# Altium schematic sheet Ethernet.SchDoc: {Наименование}
size 420 x 297 mm; DocumentNumber: ВКА.821011.000.ПЗ; PageSetup: Record=PageOptions|CenterHorizontal=False|CenterVertical=False|PrintScale=0.49|XCorrection=0.00|YCorrection=0.00|PrintKind=1|BorderSize=5000000|LeftOffset=0|BottomOffset=0|Orientation=2|PaperLength=4200|PaperWidth=2970|Scale=100|PaperSource=7|PrintQuality=600|MediaType=1|DitherType=10|PrintScaleMode=1|PaperKind=A3|PaperIndex=8; Rule: PcbType=ProtelPcb
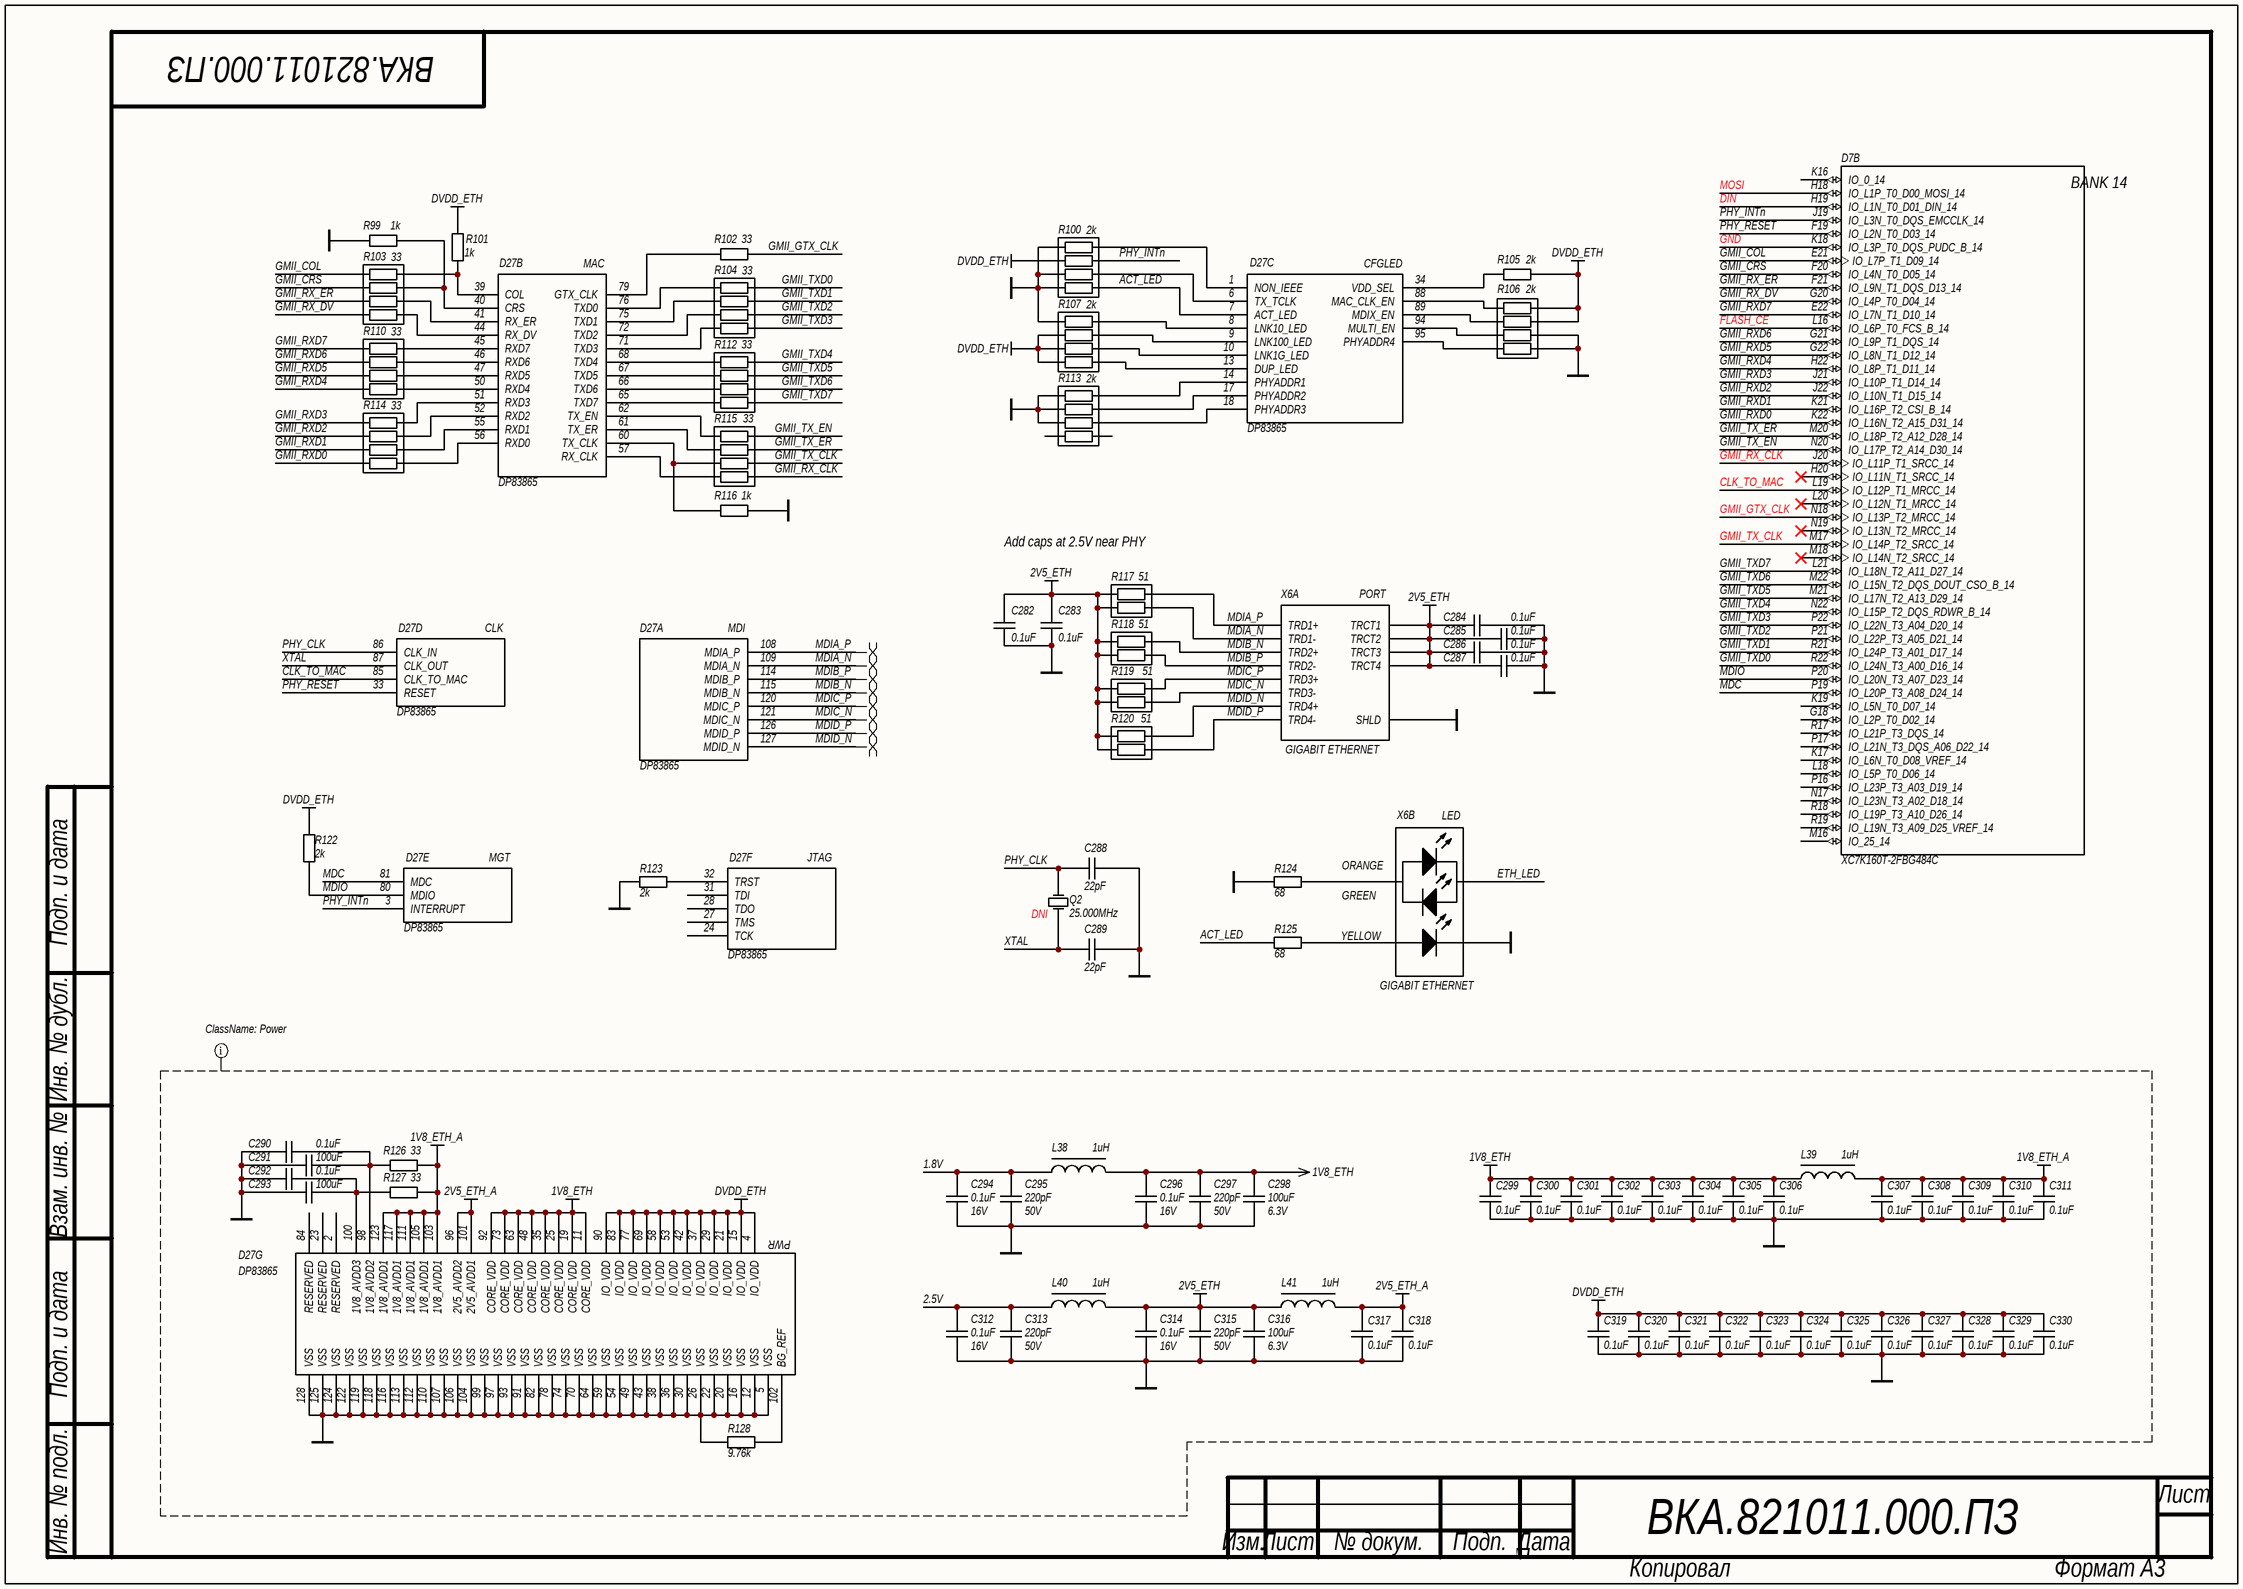
[diagram p0: Ethernet.SchDoc]

## Parts
C282  value 0.1uF  [C0402]  (hidden comment: CAP)
C283  value 0.1uF  [C0402]  (hidden comment: CAP)
C284  value 0.1uF  [C0402]  (hidden comment: CAP)
C285  value 0.1uF  [C0402]  (hidden comment: CAP)
C286  value 0.1uF  [C0402]  (hidden comment: CAP)
C287  value 0.1uF  [C0402]  (hidden comment: CAP)
C288  value 22pF  [C0402]  (hidden comment: CAP)
C289  value 22pF  [C0402]  (hidden comment: CAP)
C290  value 0.1uF  [C0402]  (hidden comment: CAP)
C291  value 100uF  [C1210]  (hidden comment: CAP uF)
C292  value 0.1uF  [C0402]  (hidden comment: CAP)
C293  value 100uF  [C1210]  (hidden comment: CAP uF)
C294  value 0.1uF  Voltage: 16V  [C0603]  (hidden comment: CAP)
C295  value 220pF  Voltage: 50V  [C0603]  (hidden comment: CAP)
C296  value 0.1uF  Voltage: 16V  [C0603]  (hidden comment: CAP)
C297  value 220pF  Voltage: 50V  [C0603]  (hidden comment: CAP)
C298  value 100uF  Voltage: 6.3V  [C1210]  (hidden comment: CAP uF)
C299  value 0.1uF  [C0402]  (hidden comment: CAP)
C300  value 0.1uF  [C0402]  (hidden comment: CAP)
C301  value 0.1uF  [C0402]  (hidden comment: CAP)
C302  value 0.1uF  [C0402]  (hidden comment: CAP)
C303  value 0.1uF  [C0402]  (hidden comment: CAP)
C304  value 0.1uF  [C0402]  (hidden comment: CAP)
C305  value 0.1uF  [C0402]  (hidden comment: CAP)
C306  value 0.1uF  [C0402]  (hidden comment: CAP)
C307  value 0.1uF  [C0402]  (hidden comment: CAP)
C308  value 0.1uF  [C0402]  (hidden comment: CAP)
C309  value 0.1uF  [C0402]  (hidden comment: CAP)
C310  value 0.1uF  [C0402]  (hidden comment: CAP)
C311  value 0.1uF  [C0402]  (hidden comment: CAP)
C312  value 0.1uF  Voltage: 16V  [C0603]  (hidden comment: CAP)
C313  value 220pF  Voltage: 50V  [C0603]  (hidden comment: CAP)
C314  value 0.1uF  Voltage: 16V  [C0603]  (hidden comment: CAP)
C315  value 220pF  Voltage: 50V  [C0603]  (hidden comment: CAP)
C316  value 100uF  Voltage: 6.3V  [C1210]  (hidden comment: CAP uF)
C317  value 0.1uF  [C0402]  (hidden comment: CAP)
C318  value 0.1uF  [C0402]  (hidden comment: CAP)
C319  value 0.1uF  [C0402]  (hidden comment: CAP)
C320  value 0.1uF  [C0402]  (hidden comment: CAP)
C321  value 0.1uF  [C0402]  (hidden comment: CAP)
C322  value 0.1uF  [C0402]  (hidden comment: CAP)
C323  value 0.1uF  [C0402]  (hidden comment: CAP)
C324  value 0.1uF  [C0402]  (hidden comment: CAP)
C325  value 0.1uF  [C0402]  (hidden comment: CAP)
C326  value 0.1uF  [C0402]  (hidden comment: CAP)
C327  value 0.1uF  [C0402]  (hidden comment: CAP)
C328  value 0.1uF  [C0402]  (hidden comment: CAP)
C329  value 0.1uF  [C0402]  (hidden comment: CAP)
C330  value 0.1uF  [C0402]  (hidden comment: CAP)
D7  XC7K160T-2FBG484C  [FBG484]  (part B of 12)
D27  DP83865  [PQFP-128]  (parts A,B,C,D,E,F,G of 7)
L38  value 1uH  [L1210_Murata LQH]  (hidden comment: Inductor LF)
L39  value 1uH  [L1210_Murata LQH]  (hidden comment: Inductor LF)
L40  value 1uH  [L1210_Murata LQH]  (hidden comment: Inductor LF)
L41  value 1uH  [L1210_Murata LQH]  (hidden comment: Inductor LF)
Q2  25.000MHz  Note: DNI  [SMT 5x7]
R99  value 1k  [R0402]  (hidden comment: RES)
R100  value 2k  [EXN8V]  (hidden comment: RES 4x0402)
R101  value 1k  [R0402]  (hidden comment: RES)
R102  value 33  [R0402]  (hidden comment: RES)
R103  value 33  [EXN8V]  (hidden comment: RES 4x0402)
R104  value 33  [EXN8V]  (hidden comment: RES 4x0402)
R105  value 2k  [R0402]  (hidden comment: RES)
R106  value 2k  [EXN8V]  (hidden comment: RES 4x0402)
R107  value 2k  [EXN8V]  (hidden comment: RES 4x0402)
R110  value 33  [EXN8V]  (hidden comment: RES 4x0402)
R112  value 33  [EXN8V]  (hidden comment: RES 4x0402)
R113  value 2k  [EXN8V]  (hidden comment: RES 4x0402)
R114  value 33  [EXN8V]  (hidden comment: RES 4x0402)
R115  value 33  [EXN8V]  (hidden comment: RES 4x0402)
R116  value 1k  [R0402]  (hidden comment: RES)
R117  value 51  [EX24V]  (hidden comment: RES 2x0402)
R118  value 51  [EX24V]  (hidden comment: RES 2x0402)
R119  value 51  [EX24V]  (hidden comment: RES 2x0402)
R120  value 51  [EX24V]  (hidden comment: RES 2x0402)
R122  value 2k  [R0402]  (hidden comment: RES)
R123  value 2k  [R0402]  (hidden comment: RES)
R124  value 68  [R0402]  (hidden comment: RES)
R125  value 68  [R0402]  (hidden comment: RES)
R126  value 33  [R0402]  (hidden comment: RES)
R127  value 33  [R0402]  (hidden comment: RES)
R128  value 9.76k  [R0402]  (hidden comment: RES)
X6  GIGABIT ETHERNET  [0826-1X1T-23-F]  (parts A,B of 2)

## Nets
1V8_ETH: C296.2 C297.2 C298.2 C299.2 C300.2 C301.2 C302.2 C303.2 C304.2 C305.2 C306.2 D27.11(CORE_VDD) D27.19(CORE_VDD) D27.25(CORE_VDD) D27.35(CORE_VDD) D27.48(CORE_VDD) D27.63(CORE_VDD) D27.73(CORE_VDD) D27.92(CORE_VDD) L38.2 L39.1
1V8_ETH_A: C307.2 C308.2 C309.2 C310.2 C311.2 D27.103(1V8_AVDD1) D27.105(1V8_AVDD1) D27.111(1V8_AVDD1) D27.117(1V8_AVDD1) D27.123(1V8_AVDD1) L39.2 R126.1 R127.1
2V5_ETH: C282.1 C283.1 C284.2 C285.2 C286.2 C287.2 C314.2 C315.2 C316.2 L40.2 L41.1 R117.1 R117.2 R118.1 R118.2 R119.1 R119.2 R120.1 R120.2 X6.1(TRCT3) X6.6(TRCT2) X6.7(TRCT4) X6.12(TRCT1)
2V5_ETH_A: C317.2 C318.2 D27.96(2V5_AVDD2) D27.101(2V5_AVDD1) L41.2
DVDD_ETH: C319.2 C320.2 C321.2 C322.2 C323.2 C324.2 C325.2 C326.2 C327.2 C328.2 C329.2 C330.2 D27.4(IO_VDD) D27.15(IO_VDD) D27.21(IO_VDD) D27.29(IO_VDD) D27.37(IO_VDD) D27.42(IO_VDD) D27.53(IO_VDD) D27.58(IO_VDD) D27.69(IO_VDD) D27.77(IO_VDD) D27.83(IO_VDD) D27.90(IO_VDD) R100.2 R101.2 R105.2 R106.5 R106.6 R107.2 R107.3 R107.4 R122.1
GND: C282.2 C283.2 C284.1 C285.1 C286.1 C287.1 C288.2 C289.2 C290.2 C291.2 C292.2 C293.2 C294.1 C295.1 C296.1 C297.1 C298.1 C299.1 C300.1 C301.1 C302.1 C303.1 C304.1 C305.1 C306.1 C307.1 C308.1 C309.1 C310.1 C311.1 C312.1 C313.1 C314.1 C315.1 C316.1 C317.1 C318.1 C319.1 C320.1 C321.1 C322.1 C323.1 C324.1 C325.1 C326.1 C327.1 C328.1 C329.1 C330.1 D7.K18(IO_L3P_T0_DQS_PUDC_B_14) D27.5(VSS) D27.12(VSS) D27.16(VSS) D27.20(VSS) D27.22(VSS) D27.26(VSS) D27.30(VSS) D27.36(VSS) D27.38(VSS) D27.43(VSS) D27.49(VSS) D27.54(VSS) D27.59(VSS) D27.64(VSS) D27.70(VSS) D27.74(VSS) D27.78(VSS) D27.82(VSS) D27.91(VSS) D27.93(VSS) D27.97(VSS) D27.99(VSS) D27.104(VSS) D27.106(VSS) D27.107(VSS) D27.110(VSS) D27.112(VSS) D27.113(VSS) D27.116(VSS) D27.118(VSS) D27.119(VSS) D27.122(VSS) D27.124(VSS) D27.125(VSS) D27.128(VSS) R99.2 R100.1 R100.3 R100.4 R106.7 R106.8 R107.1 R113.1 R113.2 R113.3 R116.2 R123.1 R124.1 R128.2 X6.0(SHLD) X6.13(LED1)
1.8V: C294.2 C295.2 L38.1
2.5V: C312.2 C313.2 L40.1
ACT_LED: D27.7(ACT_LED) R100.5 R125.1
CLK_TO_MAC: D7.L19(IO_L12P_T1_MRCC_14) D27.85(CLK_TO_MAC)
DIN: D7.H19(IO_L1N_T0_D01_DIN_14)
ETH_LED: X6.16(LED2)
FLASH_CE: D7.L16(IO_L6P_T0_FCS_B_14)
GMII_COL: D7.E21(IO_L7P_T1_D09_14) R103.1
GMII_CRS: D7.F20(IO_L4N_T0_D05_14) R103.2
GMII_GTX_CLK: D7.N18(IO_L13P_T2_MRCC_14) R102.2
GMII_RX_CLK: D7.J20(IO_L11P_T1_SRCC_14) R115.1
GMII_RX_DV: D7.G20(IO_L4P_T0_D04_14) R103.4
GMII_RX_ER: D7.F21(IO_L9N_T1_DQS_D13_14) R103.3
GMII_RXD0: D7.K22(IO_L16N_T2_A15_D31_14) R114.4
GMII_RXD1: D7.K21(IO_L16P_T2_CSI_B_14) R114.3
GMII_RXD2: D7.J22(IO_L10N_T1_D15_14) R114.2
GMII_RXD3: D7.J21(IO_L10P_T1_D14_14) R114.1
GMII_RXD4: D7.H22(IO_L8P_T1_D11_14) R110.4
GMII_RXD5: D7.G22(IO_L8N_T1_D12_14) R110.3
GMII_RXD6: D7.G21(IO_L9P_T1_DQS_14) R110.2
GMII_RXD7: D7.E22(IO_L7N_T1_D10_14) R110.1
GMII_TX_CLK: D7.M17(IO_L14P_T2_SRCC_14) R115.2
GMII_TX_EN: D7.N20(IO_L17P_T2_A14_D30_14) R115.4
GMII_TX_ER: D7.M20(IO_L18P_T2_A12_D28_14) R115.3
GMII_TXD0: D7.R22(IO_L24N_T3_A00_D16_14) R104.8
GMII_TXD1: D7.R21(IO_L24P_T3_A01_D17_14) R104.7
GMII_TXD2: D7.P21(IO_L22P_T3_A05_D21_14) R104.6
GMII_TXD3: D7.P22(IO_L22N_T3_A04_D20_14) R104.5
GMII_TXD4: D7.N22(IO_L15P_T2_DQS_RDWR_B_14) R112.4
GMII_TXD5: D7.M21(IO_L17N_T2_A13_D29_14) R112.3
GMII_TXD6: D7.M22(IO_L15N_T2_DQS_DOUT_CSO_B_14) R112.2
GMII_TXD7: D7.L21(IO_L18N_T2_A11_D27_14) R112.1
MDC: D7.P19(IO_L20P_T3_A08_D24_14) D27.81(MDC)
MDIA_N: D27.109(MDIA_N) R117.3 X6.10(TRD1-)
MDIA_P: D27.108(MDIA_P) R117.4 X6.11(TRD1+)
MDIB_N: D27.115(MDIB_N) R118.4 X6.4(TRD2+)
MDIB_P: D27.114(MDIB_P) R118.3 X6.5(TRD2-)
MDIC_N: D27.121(MDIC_N) R119.4 X6.2(TRD3-)
MDIC_P: D27.120(MDIC_P) R119.3 X6.3(TRD3+)
MDID_N: D27.127(MDID_N) R120.3 X6.8(TRD4+)
MDID_P: D27.126(MDID_P) R120.4 X6.9(TRD4-)
MDIO: D7.P20(IO_L20N_T3_A07_D23_14) D27.80(MDIO) R122.2
MOSI: D7.H18(IO_L1P_T0_D00_MOSI_14)
PHY_CLK: C288.1 D27.86(CLK_IN) Q2.3(OSC2)
PHY_INTn: D7.J19(IO_L3N_T0_DQS_EMCCLK_14) D27.3(INTERRUPT) R100.7
PHY_RESET: D7.F19(IO_L2N_T0_D03_14) D27.33(RESET)
XTAL: C289.1 D27.87(CLK_OUT) Q2.1(OSC1)
NetC290_1: C290.1 C291.1 D27.98(1V8_AVDD2) R126.2
NetC292_1: C292.1 C293.1 D27.100(1V8_AVDD3) R127.2
NetD27_1: D27.1(NON_IEEE) R100.8
NetD27_6: D27.6(TX_TCLK) R100.6
NetD27_8: D27.8(LNK10_LED) R107.8
NetD27_9: D27.9(LNK100_LED) R107.7
NetD27_10: D27.10(LNK1G_LED) R107.6
NetD27_13: D27.13(DUP_LED) R107.5
NetD27_14: D27.14(PHYADDR1) R113.8
NetD27_17: D27.17(PHYADDR2) R113.7
NetD27_18: D27.18(PHYADDR3) R113.6
NetD27_32: D27.32(TRST) R123.2
NetD27_34: D27.34(VDD_SEL) R105.1
NetD27_39: D27.39(COL) R101.1 R103.8
NetD27_40: D27.40(CRS) R99.1 R103.7
NetD27_41: D27.41(RX_ER) R103.6
NetD27_44: D27.44(RX_DV) R103.5
NetD27_45: D27.45(RXD7) R110.8
NetD27_46: D27.46(RXD6) R110.7
NetD27_47: D27.47(RXD5) R110.6
NetD27_50: D27.50(RXD4) R110.5
NetD27_51: D27.51(RXD3) R114.8
NetD27_52: D27.52(RXD2) R114.7
NetD27_55: D27.55(RXD1) R114.6
NetD27_56: D27.56(RXD0) R114.5
NetD27_57: D27.57(RX_CLK) R115.8
NetD27_60: D27.60(TX_CLK) R115.7 R116.1
NetD27_61: D27.61(TX_ER) R115.6
NetD27_62: D27.62(TX_EN) R115.5
NetD27_65: D27.65(TXD7) R112.8
NetD27_66: D27.66(TXD6) R112.7
NetD27_67: D27.67(TXD5) R112.6
NetD27_68: D27.68(TXD4) R112.5
NetD27_71: D27.71(TXD3) R104.4
NetD27_72: D27.72(TXD2) R104.3
NetD27_75: D27.75(TXD1) R104.2
NetD27_76: D27.76(TXD0) R104.1
NetD27_79: D27.79(GTX_CLK) R102.1
NetD27_88: D27.88(MAC_CLK_EN) R106.4
NetD27_89: D27.89(MDIX_EN) R106.3
NetD27_94: D27.94(MULTI_EN) R106.2
NetD27_95: D27.95(PHYADDR4) R106.1
NetD27_102: D27.102(BG_REF) R128.1
NetR124_2: R124.2 X6.15
NetR125_2: R125.2 X6.14

Not connected (* = marked no-connect by the designer): D7 G18(IO_L2P_T0_D02_14) H20(IO_L11N_T1_SRCC_14)* K16(IO_0_14) K17(IO_L6N_T0_D08_VREF_14) K19(IO_L5N_T0_D07_14) L18(IO_L5P_T0_D06_14) L20(IO_L12N_T1_MRCC_14)* M16(IO_25_14) M18(IO_L14N_T2_SRCC_14)* N17(IO_L23N_T3_A02_D18_14) N19(IO_L13N_T2_MRCC_14)* P16(IO_L23P_T3_A03_D19_14) P17(IO_L21N_T3_DQS_A06_D22_14) R17(IO_L21P_T3_DQS_14) R18(IO_L19P_T3_A10_D26_14) R19(IO_L19N_T3_A09_D25_VREF_14); D27 2(RESERVED) 23(RESERVED) 24(TCK) 27(TMS) 28(TDO) 31(TDI) 84(RESERVED); R113 4 5

## Layout directives
net class Power: 1.8V, 1V8_ETH, 1V8_ETH_A, 2.5V, 2V5_ETH, 2V5_ETH_A, DVDD_ETH, GND
differential pair: MDIA_N, MDIA_P, MDIB_N, MDIB_P, MDIC_N, MDIC_P, MDID_N, MDID_P

## Notes on the sheet
- Add caps at 2.5V near PHY
- Подп. и дата
- Инв. № дубл.
- Взам. инв. №
- Инв. № подл.
- Лист
- Изм.
- № докум.
- Подп.
- Дата
- Копировал
- Формат А3
- (in symbol 0826-1X1T-23-F, part A) PORT
- (in symbol 0826-1X1T-23-F, part B) LED; ORANGE; GREEN; YELLOW
- (in symbol DP83865, part A) MDI
- (in symbol DP83865, part B) MAC
- (in symbol DP83865, part C) CFGLED
- (in symbol DP83865, part D) CLK
- (in symbol DP83865, part E) MGT
- (in symbol DP83865, part F) JTAG
- (in symbol DP83865, part G) PWR
- (in symbol XC7K160T-2FBG484C, part B) BANK 14

## Library data of the parts
C282-C287 = CAP: SMD Capacitor; Manufacturer: Murata; Material: X7R; Tolerance: 10%; Voltage: 50V; Type: Ceramic Capacitor; P/N: GRM155R71H104KE14J
C288 C289 = CAP: SMD Capacitor; Manufacturer: Murata; Material: NP0; Tolerance: 1%; Voltage: 25V; Type: Ceramic Capacitor; P/N: GRM1555C1E220JA01D
C290 C292 C299-C311 C317-C330 = CAP: SMD Capacitor; Manufacturer: Murata; Material: X7R; Tolerance: 10%; Voltage: 16V; Type: Ceramic Capacitor; P/N: GRM155R71C104KA88J
C291 C293 = CAP uF: SMD Capacitor; Manufacturer: Murata; Material: X5R; Tolerance: 20%; Voltage: 6.3V; Type: Ceramic Capacitor; P/N: GRM32ER60J107ME20L
C294 C296 C312 C314 = CAP: SMD Capacitor; Manufacturer: Murata; Material: X7R; Tolerance: 10%; Type: Ceramic Capacitor; P/N: GRM188R71C104KA01D
C295 C297 C313 C315 = CAP: SMD Capacitor; Manufacturer: Murata; Material: X7R; Tolerance: 10%; Type: Ceramic Capacitor; P/N: GRM188R71H221KA01D
C298 C316 = CAP uF: SMD Capacitor; Manufacturer: Murata; Material: X5R; Tolerance: 20%; Type: Ceramic Capacitor; P/N: GRM32ER60J107ME20L
D7 = XC7K160T-2FBG484C: Xilinx 7-Series FPGA; Speed Grade: -2; Manufacturer: Xilinx; Name: XC7K160T-2FBG484C; Series: 7-Series FPGA; Package: 484 Ball FBG
D27 = DP83865: 10/100/1000 Ethernet Physical Layer; Name: DP83865DVH; Package: LQFP-128; Type: 0/100/1000 Ethernet Physical Layer
L38-L41 = Inductor LF: Inductor Power Lines; Manufacturer: Murata; Name: LQH32PN1R0NNC; Current: 2500mA; Tolerance: 5%; Frequency: 100MHz; Temperature Range: -25ºC to 85ºC; Series: LQH; P/N: LQH32PN1R0NNC
Q2 = Quartz: Qurtz; Manufacturer: GEYER ELECTRONIC; Name: KX-13T; Tolerance: ± 30 ppm; Frequancy: 25.000MHz
R99 R101 R116 = RES: SMD Resistor; Name: Chip SMD Resistor; Power: 0.062 Wt; Tolerance: 5%; P/N: ERJ-2GEJ102X; Temperature Range: -55…155°C
R100 R106 R107 R113 = RES 4x0402: Chip Resistor Array; Manufacturer: Panasonic; Name: EXBN8V; Number of Resistors: 4; Tolerance: 5%; P/N: EXB-N8V202JX; Type: 0402 Array Concave Terminal; Number of Terminals: 8; Series: EXB
R102 = RES: SMD Resistor; Name: Chip SMD Resistor; Power: 0.062 Wt; Tolerance: 5%; P/N: ERJ-2GEJ330X; Temperature Range: -55…155°C
R103 R104 R110 R112 R114 R115 = RES 4x0402: Chip Resistor Array; Manufacturer: Panasonic; Name: EXBN8V; Number of Resistors: 4; Tolerance: 5%; P/N: EXB-N8V330JX; Type: 0402 Array Concave Terminal; Number of Terminals: 8; Series: EXB
R105 R122 R123 = RES: SMD Resistor; Name: Chip SMD Resistor; Power: 0.062 Wt; Tolerance: 5%; P/N: ERJ-2GEJ202X; Temperature Range: -55…155°C
R117-R120 = RES 2x0402: Chip Resistor Array; Manufacturer: Panasonic; Name: EXB24V; Number of Resistors: 2; Tolerance: 5%; P/N: EXB-24V510JX; Type: 0402 Array Convex Terminal; Number of Terminals: 4; Series: EXB
R124 R125 = RES: SMD Resistor; Name: Chip SMD Resistor; Power: 0.062 Wt; Tolerance: 5%; P/N: ERJ-2GEJ680X; Temperature Range: -55…155°C
R126 R127 = RES: SMD Resistor; Manufacturer: Panasonic Electronic Components; Name: Chip SMD Resistor; Power: 0.062 Wt; Tolerance: 5%; P/N: ERJ-2GEJ330X; Temperature Range: -55…155°C
R128 = RES: SMD Resistor; Manufacturer: Panasonic Electronic Components; Name: Chip SMD Resistor; Power: 0.062 Wt; Tolerance: 5%; P/N: ERJ-2RKF9761X; Temperature Range: -55…155°C
X6 = 0826-1X1T-23-F: Gigabit Ethernet Single Port with LEDs; Name: 0826-1X1T-23-F; Type: Gigabit Ethernet Single Port with LEDs